# EAGLE design ConfundusV2 (EAGLE 9.6.2)
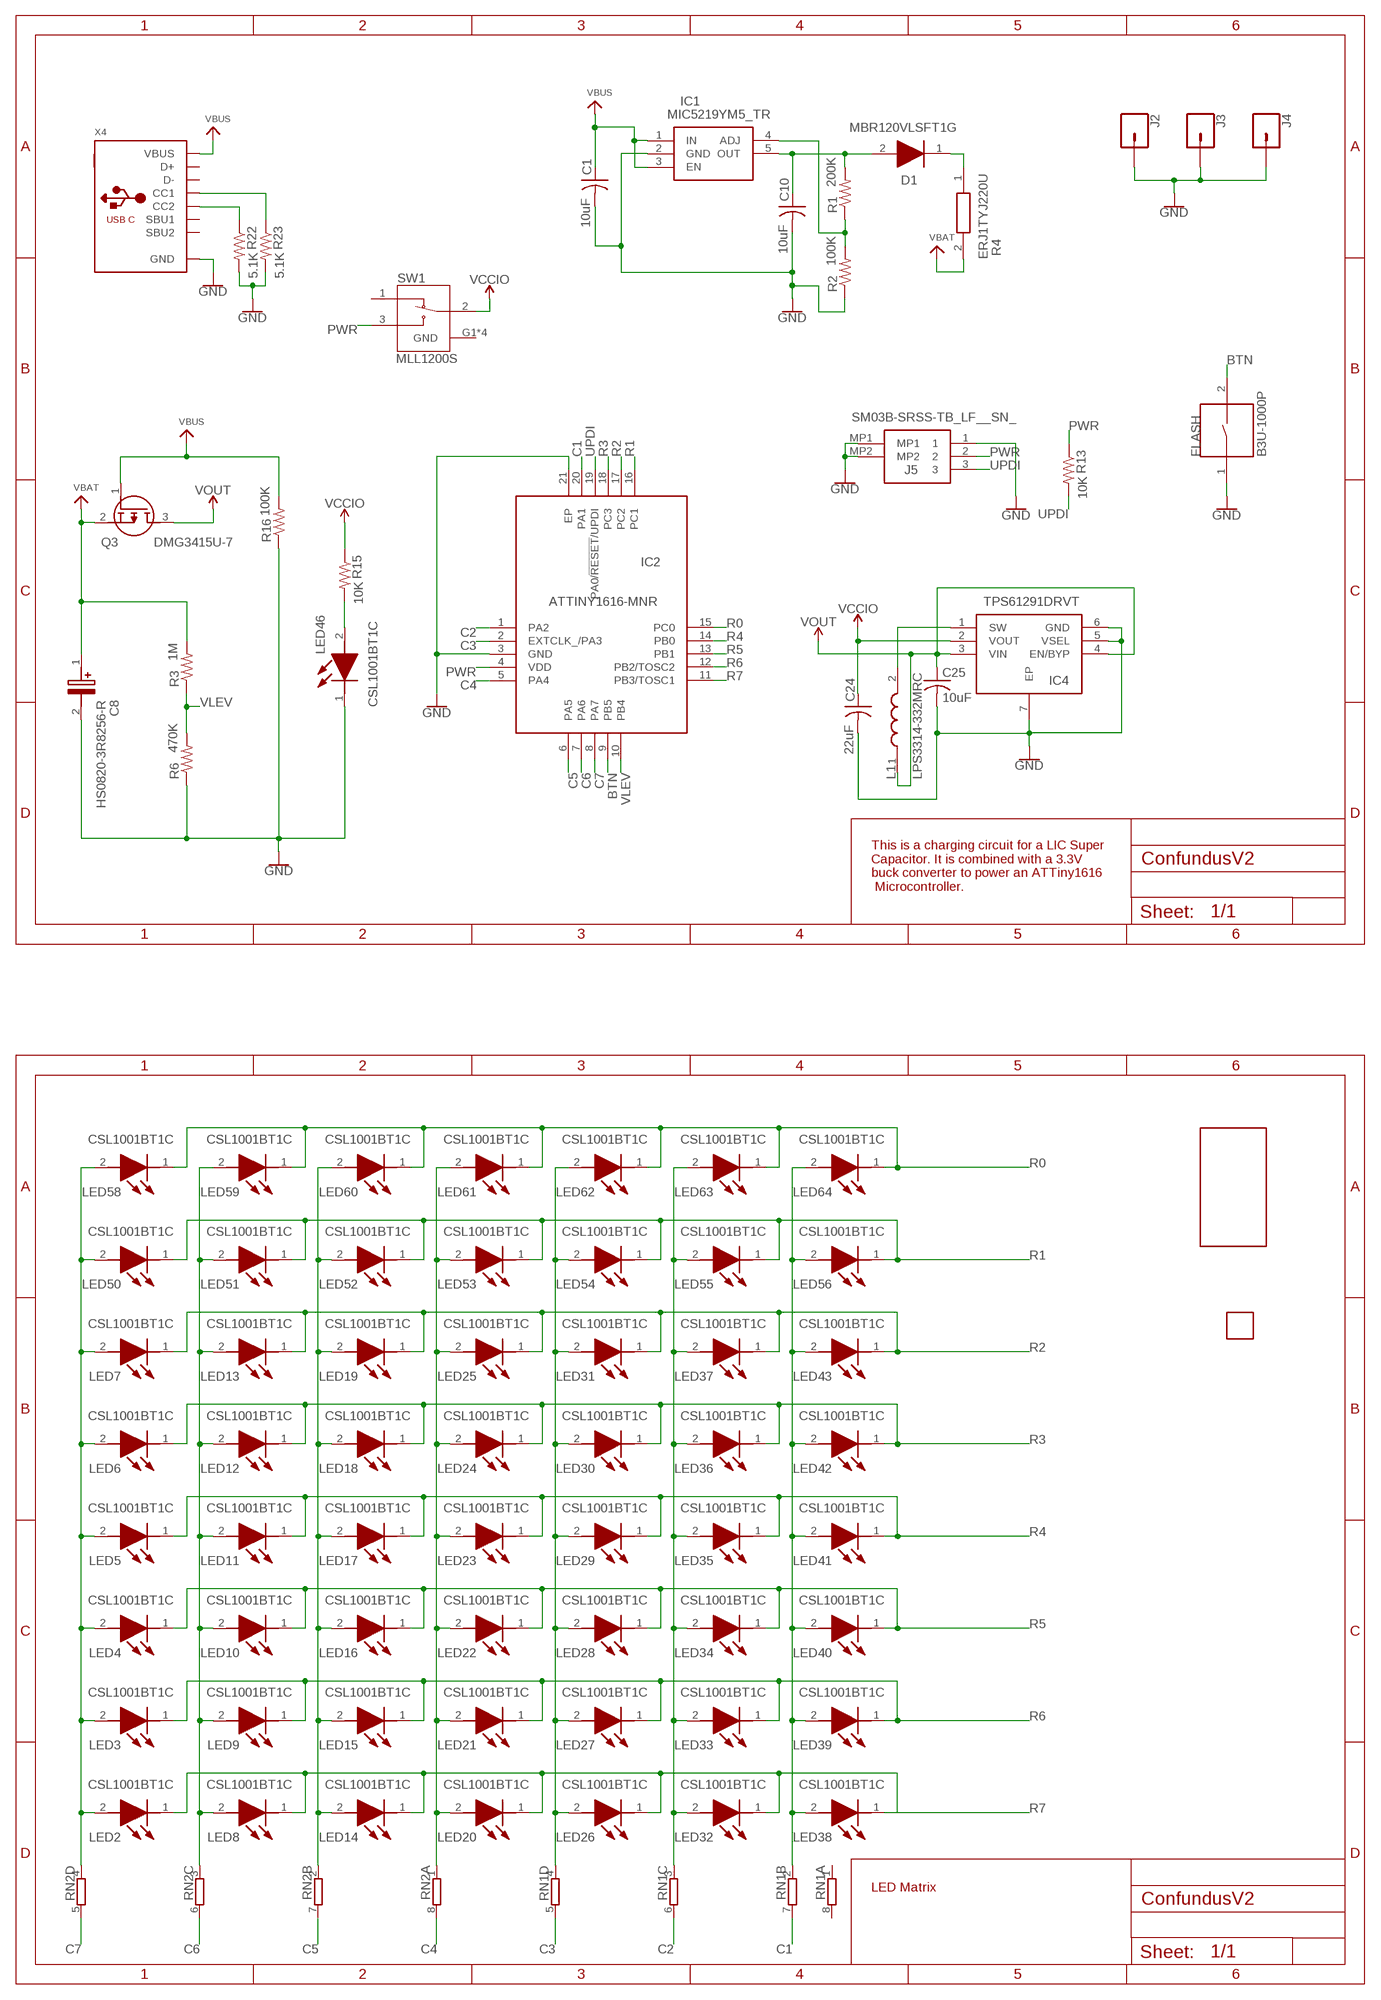
[diagram p0: schematic, sheet 1]

## Parts
C1  10uF  C-USC0402  [C0402]
C8  HS0820-3R8256-R  [CAPPRD350W65D850H2200]
C10  10uF  C-USC0402  [C0402]
C24  22uF  C-USC0402  [C0402]
C25  10uF  C-USC0402  [C0402]
D1  MBR120VLSFT1G  [SODFL3616X98N]
FLASH  B3U-1000P  [SW_B3U-1000P]
IC1  MIC5219YM5_TR  [SOT95P280X145-5N]
IC2  ATTINY1616-MNR  [QFN40P300X300X90-21N]
IC4  TPS61291DRVT  [SON65P200X200X80-7N]
J2  CONN_01PTH_2MM  [1X01_2MM]
J3  CONN_01PTH_2MM  [1X01_2MM]
J4  CONN_01PTH_2MM  [1X01_2MM]
J5  SM03B-SRSS-TB_LF__SN_  [SM03BSRSSTBLFSN]
L1  LPS3314-332MRC  [LPS3314332MRC]
LED2  CSL1001BT1C  [CSL1001BT1C]
LED3  CSL1001BT1C  [CSL1001BT1C]
LED4  CSL1001BT1C  [CSL1001BT1C]
LED5  CSL1001BT1C  [CSL1001BT1C]
LED6  CSL1001BT1C  [CSL1001BT1C]
LED7  CSL1001BT1C  [CSL1001BT1C]
LED8  CSL1001BT1C  [CSL1001BT1C]
LED9  CSL1001BT1C  [CSL1001BT1C]
LED10  CSL1001BT1C  [CSL1001BT1C]
LED11  CSL1001BT1C  [CSL1001BT1C]
LED12  CSL1001BT1C  [CSL1001BT1C]
LED13  CSL1001BT1C  [CSL1001BT1C]
LED14  CSL1001BT1C  [CSL1001BT1C]
LED15  CSL1001BT1C  [CSL1001BT1C]
LED16  CSL1001BT1C  [CSL1001BT1C]
LED17  CSL1001BT1C  [CSL1001BT1C]
LED18  CSL1001BT1C  [CSL1001BT1C]
LED19  CSL1001BT1C  [CSL1001BT1C]
LED20  CSL1001BT1C  [CSL1001BT1C]
LED21  CSL1001BT1C  [CSL1001BT1C]
LED22  CSL1001BT1C  [CSL1001BT1C]
LED23  CSL1001BT1C  [CSL1001BT1C]
LED24  CSL1001BT1C  [CSL1001BT1C]
LED25  CSL1001BT1C  [CSL1001BT1C]
LED26  CSL1001BT1C  [CSL1001BT1C]
LED27  CSL1001BT1C  [CSL1001BT1C]
LED28  CSL1001BT1C  [CSL1001BT1C]
LED29  CSL1001BT1C  [CSL1001BT1C]
LED30  CSL1001BT1C  [CSL1001BT1C]
LED31  CSL1001BT1C  [CSL1001BT1C]
LED32  CSL1001BT1C  [CSL1001BT1C]
LED33  CSL1001BT1C  [CSL1001BT1C]
LED34  CSL1001BT1C  [CSL1001BT1C]
LED35  CSL1001BT1C  [CSL1001BT1C]
LED36  CSL1001BT1C  [CSL1001BT1C]
LED37  CSL1001BT1C  [CSL1001BT1C]
LED38  CSL1001BT1C  [CSL1001BT1C]
LED39  CSL1001BT1C  [CSL1001BT1C]
LED40  CSL1001BT1C  [CSL1001BT1C]
LED41  CSL1001BT1C  [CSL1001BT1C]
LED42  CSL1001BT1C  [CSL1001BT1C]
LED43  CSL1001BT1C  [CSL1001BT1C]
LED46  CSL1001BT1C  [CSL1001BT1C]
LED50  CSL1001BT1C  [CSL1001BT1C]
LED51  CSL1001BT1C  [CSL1001BT1C]
LED52  CSL1001BT1C  [CSL1001BT1C]
LED53  CSL1001BT1C  [CSL1001BT1C]
LED54  CSL1001BT1C  [CSL1001BT1C]
LED55  CSL1001BT1C  [CSL1001BT1C]
LED56  CSL1001BT1C  [CSL1001BT1C]
LED58  CSL1001BT1C  [CSL1001BT1C]
LED59  CSL1001BT1C  [CSL1001BT1C]
LED60  CSL1001BT1C  [CSL1001BT1C]
LED61  CSL1001BT1C  [CSL1001BT1C]
LED62  CSL1001BT1C  [CSL1001BT1C]
LED63  CSL1001BT1C  [CSL1001BT1C]
LED64  CSL1001BT1C  [CSL1001BT1C]
Q3  DMG3415U-7  [SOT96P240X100-3N]
R1  200K  R-US_R0402  [R0402]
R2  100K  R-US_R0402  [R0402]
R3  1M  R-US_R0402  [R0402]
R4  ERJ1TYJ220U  [ERJ1TRQF1R0U]
R6  470K  R-US_R0402  [R0402]
R13  10K  R-US_R0402  [R0402]
R15  10K  R-US_R0402  [R0402]
R16  100K  R-US_R0402  [R0402]
R22  5.1K  R-US_R0402  [R0402]
R23  5.1K  R-US_R0402  [R0402]
RN1  4R-N0402ARV341  [4X0402ARV341]
RN2  4R-N0402ARV341  [4X0402ARV341]
SW1  MLL1200S  [SW_MLL1200S]
U$1  SMARTT  [SMARTT]
U$2  SMARTT_SMALL  [SMARTT_SMALL]
X4  MICROBUILDER_USB_C  [MICROBUILDER_USB_C_CUSB31-CFM2AX-01-X]

## Nets
BTN: FLASH.2 IC2.9(PB5)
C1: IC2.20(PA1) RN1.7
C2: IC2.1(PA2) RN1.6
C3: IC2.2(EXTCLK_/PA3) RN1.5
C4: IC2.5(PA4) RN2.8
C5: IC2.6(PA5) RN2.7
C6: IC2.7(PA6) RN2.6
C7: IC2.8(PA7) RN2.5
GND: C1.2 C8.2(-) C10.2 C24.2 C25.2 FLASH.1 IC1.2(GND) IC2.3(GND) IC2.21(EP) IC4.5(VSEL) IC4.6(GND) IC4.7(EP) J2.1 J3.1 J4.1 J5.1 J5.MP1 J5.MP2 LED46.1(K) R2.1 R6.1 R16.1 R22.2 R23.2 X4.A1B12(GND) X4.B1A12(GND)
N$1: LED38.2(A) LED39.2(A) LED40.2(A) LED41.2(A) LED42.2(A) LED43.2(A) LED56.2(A) LED64.2(A) RN1.2
N$2: LED32.2(A) LED33.2(A) LED34.2(A) LED35.2(A) LED36.2(A) LED37.2(A) LED55.2(A) LED63.2(A) RN1.3
N$3: LED26.2(A) LED27.2(A) LED28.2(A) LED29.2(A) LED30.2(A) LED31.2(A) LED54.2(A) LED62.2(A) RN1.4
N$4: LED20.2(A) LED21.2(A) LED22.2(A) LED23.2(A) LED24.2(A) LED25.2(A) LED53.2(A) LED61.2(A) RN2.1
N$5: LED14.2(A) LED15.2(A) LED16.2(A) LED17.2(A) LED18.2(A) LED19.2(A) LED52.2(A) LED60.2(A) RN2.2
N$6: LED8.2(A) LED9.2(A) LED10.2(A) LED11.2(A) LED12.2(A) LED13.2(A) LED51.2(A) LED59.2(A) RN2.3
N$7: LED2.2(A) LED3.2(A) LED4.2(A) LED5.2(A) LED6.2(A) LED7.2(A) LED50.2(A) LED58.2(A) RN2.4
N$8: R22.1 X4.B5(CC2)
N$9: R23.1 X4.A5(CC1)
N$10: C10.1 D1.2(A) IC1.5(OUT) R1.2
N$11: IC1.4(ADJ) R1.1 R2.2
N$12: D1.1(K) R4.1
N$28: IC4.1(SW) L1.2
N$36: LED46.2(A) R15.2
PWR: IC2.4(VDD) J5.2 R13.1 SW1.3
R0: IC2.15(PC0) LED58.1(K) LED59.1(K) LED60.1(K) LED61.1(K) LED62.1(K) LED63.1(K) LED64.1(K)
R1: IC2.16(PC1) LED50.1(K) LED51.1(K) LED52.1(K) LED53.1(K) LED54.1(K) LED55.1(K) LED56.1(K)
R2: IC2.17(PC2) LED7.1(K) LED13.1(K) LED19.1(K) LED25.1(K) LED31.1(K) LED37.1(K) LED43.1(K)
R3: IC2.18(PC3) LED6.1(K) LED12.1(K) LED18.1(K) LED24.1(K) LED30.1(K) LED36.1(K) LED42.1(K)
R4: IC2.14(PB0) LED5.1(K) LED11.1(K) LED17.1(K) LED23.1(K) LED29.1(K) LED35.1(K) LED41.1(K)
R5: IC2.13(PB1) LED4.1(K) LED10.1(K) LED16.1(K) LED22.1(K) LED28.1(K) LED34.1(K) LED40.1(K)
R6: IC2.12(PB2/TOSC2) LED3.1(K) LED9.1(K) LED15.1(K) LED21.1(K) LED27.1(K) LED33.1(K) LED39.1(K)
R7: IC2.11(PB3/TOSC1) LED2.1(K) LED8.1(K) LED14.1(K) LED20.1(K) LED26.1(K) LED32.1(K) LED38.1(K)
UPDI: IC2.19(PA0/!RESET!/UPDI) J5.3 R13.2
VBAT: C8.1(+) Q3.2(S) R3.2 R4.2
VBUS: C1.1 IC1.1(IN) IC1.3(EN) Q3.1(G) R16.2 X4.A4B9(VBUS) X4.B4A9(VBUS)
VCCIO: C24.1 IC4.2(VOUT) R15.1 SW1.2
VLEV: IC2.10(PB4) R3.1 R6.2
VOUT: C25.1 IC4.3(VIN) IC4.4(EN/BYP) L1.1 Q3.3(D)
Unconnected: RN1.1 RN1.8 SW1.1 X4.A6(D+) X4.A7(D-) X4.A8(SBU1) X4.B6(D+) X4.B7(D-) X4.B8(SBU2)

## Notes on the sheet
- This is a charging circuit for a LIC Super  
  Capacitor. It is combined with a 3.3V 
  buck converter to power an ATTiny1616
   Microcontroller.
- LED Matrix

## Power pins joined to a net without a drawn wire
GND: SW1.G1(GND) SW1.G2(GND) SW1.G3(GND) SW1.G4(GND)

## Library data of the parts
C1 C10 C24 C25 = adafruit:C-US: CAPACITOR, American symbol
C8 = HS0820-3R8256-R:HS0820-3R8256-R: Supercapacitors / Ultracapacitors Eaton HS Hybrid Supercapacitor, 3.8V, 25F, 0.65 ohm Source: Datasheet <https://www.eaton.com/content/dam/eaton/products/electronic-components/resources/data-sheet/eaton-supercapacitor-hybrid-cylindrical-cells-data-sheet.pdf>; DESCRIPTION: Supercapacitors / Ultracapacitors Eaton HS Hybrid Supercapacitor, 3.8V, 25F, 0.65 ohm; HEIGHT: 22mm; MANUFACTURER_NAME: Eaton; MANUFACTURER_PART_NUMBER: HS0820-3R8256-R; MOUSER_PART_NUMBER: 504-HS0820-3R8256-R; MOUSER_PRICE-STOCK: https://www.mouser.co.uk/ProductDetail/Eaton-Electronics/HS0820-3R8256-R?qs=MyNHzdoqoQLzawSJmBp97w%3D%3D
D1 = MBR120VLSFT1G:MBR120VLSFT1G: Diode Schottky 20V 1A SOD123FL ON Semi MBR120VLSFT1G, SMT Schottky Diode, 20V 1A, 2-Pin SOD-123FL Source: Datasheet <http://www.onsemi.com/pub/Collateral/MBR120VLSFT1-D.PDF>; DESCRIPTION: Diode Schottky 20V 1A SOD123FL ON Semi MBR120VLSFT1G, SMT Schottky Diode, 20V 1A, 2-Pin SOD-123FL; HEIGHT: 0.98mm; MANUFACTURER_NAME: ON Semiconductor; MANUFACTURER_PART_NUMBER: MBR120VLSFT1G; MOUSER_PART_NUMBER: 863-MBR120VLSFT1G; MOUSER_PRICE-STOCK: https://www.mouser.co.uk/ProductDetail/ON-Semiconductor/MBR120VLSFT1G?qs=3JMERSakebpX%252BkItPpFCkg%3D%3D
FLASH = B3U-1000P:B3U-1000P: Switch Tactile N.O. SPST Round Button Gull Wing 0.05A 12VDC 1.5N SMD Embossed T/R; AVAILABILITY: Unavailable; DESCRIPTION: Switch Tactile N.O. SPST Round Button Gull Wing 0.05A 12VDC 1.5N SMD Embossed T/R; MF: Omron; MP: B3U-1000P; PACKAGE: None; PRICE: None
IC1 = MIC5219YM5_TR:MIC5219YM5_TR: Micrel MIC5219YM5 TR, Low Noise LDO Voltage Regulator, 500mA Adjustable, +/-1% 5-Pin, SOT-23 Source: Datasheet <https://www.mouser.co.uk/datasheet/2/268/mic5219-1082354.pdf>; ARROW_PART_NUMBER: MIC5219YM5 TR; ARROW_PRICE-STOCK: https://www.arrow.com/en/products/mic5219ym5-tr/microchip-technology.html?utm_currency=USD&region=nac; DESCRIPTION: Micrel MIC5219YM5 TR, Low Noise LDO Voltage Regulator, 500mA Adjustable, +/-1% 5-Pin, SOT-23; HEIGHT: 1.45mm; MANUFACTURER_NAME: Microchip; MANUFACTURER_PART_NUMBER: MIC5219YM5 TR
IC2 = ATTINY1616-MNR:ATTINY1616-MNR: Microchip ATTINY1616-MNR, 8bit AVR Microcontroller, 20MHz, 16 kB Flash, 20-Pin VQFN Source: Datasheet <https://datasheet.datasheetarchive.com/originals/distributors/DKDS41/DSANUWW0026757.pdf>; DESCRIPTION: Microchip ATTINY1616-MNR, 8bit AVR Microcontroller, 20MHz, 16 kB Flash, 20-Pin VQFN; HEIGHT: 0.9mm; MANUFACTURER_NAME: Microchip; MANUFACTURER_PART_NUMBER: ATTINY1616-MNR; MOUSER_PART_NUMBER: 556-ATTINY1616MNR; MOUSER_PRICE-STOCK: https://www.mouser.co.uk/ProductDetail/Microchip-Technology/ATTINY1616-MNR?qs=HXFqYaX1Q2yKNpuKQU9qww%3D%3D
IC4 = TPS61291DRVT:TPS61291DRVT: Texas Instruments TPS61291DRVT, Boost Converter, Boost 250mA Selectable, 2.5 V, 3 V, 3.3 V, 6-Pin SON Source: Datasheet <http://uk.rs-online.com/web/p/products/9143112P>; ARROW_PART_NUMBER: TPS61291DRVT; ARROW_PRICE-STOCK: https://www.arrow.com/en/products/tps61291drvt/texas-instruments?utm_currency=USD&region=nac; DESCRIPTION: Texas Instruments TPS61291DRVT, Boost Converter, Boost 250mA Selectable, 2.5 V, 3 V, 3.3 V, 6-Pin SON; HEIGHT: 0.8mm; MANUFACTURER_NAME: Texas Instruments; MANUFACTURER_PART_NUMBER: TPS61291DRVT; MOUSER_PART_NUMBER: 595-TPS61291DRVT; MOUSER_PRICE-STOCK: https://www.mouser.co.uk/ProductDetail/Texas-Instruments/TPS61291DRVT?qs=6E8igxPflKclok%252BjdNvlFw%3D%3D
J2-J4 = SparkFun-Connectors:CONN_01: Single connection point. Often used as Generic Header-pin footprint for 0.1 inch spaced/style header connections On any of the 0.1 inch spaced packages, you can populate with these: Break Away Headers - Straight <https://www.sparkfun.com/products/116> (PRT-00116) Break Away Male Headers - Right Angle <https://www.sparkfun.com/products/553> (PRT-00553) Female Headers <https://www.sparkfun.com/products/115> (PRT-00115) Break Away Headers - Machine Pin <https://www.sparkfun.com/products/117> (PRT-00117) Break Away Female Headers - Swiss Machine Pin <https://www.sparkfun.com/products/743> (PRT-00743) This device is also useful as a general connection point to wire up your design to another part of your project. Our various solder wires solder well into these plated through hole pads. Hook-Up Wire - Assortment (Stranded, 22 AWG) <https://www.sparkfun.com/products/11375> (PRT-11375) Hook-Up Wire - Assortment (Solid Core, 22 AWG) <https://www.sparkfun.com/products/11367> (PRT-11367) View the entire wire category on our website here <https://www.sparkfun.com/categories/141> Special notes: SMTSO-256-ET is a "flush mount" nut for a 4-40 screw. We mostly use this on specialty testbeds; it is a nice way to connect hardware to your PCB at an adjustable hieght. Also note, the SNAP packages are for using a snappable style connector. We sell a baggie of snaps and they are also used on two LilyPad designs: Snap Assortment - 30 pack (male and female) <https://www.sparkfun.com/products/11347> (DEV-11347) LilyPad Arduino SimpleSnap <https://www.sparkfun.com/products/10941> (DEV-10941) LilyPad SimpleSnap Protoboard <https://www.sparkfun.com/products/10940> (DEV-10940)
J5 = SM03B-SRSS-TB_LF__SN_:SM03B-SRSS-TB_LF__SN_: Wire To Board / Wire To Wire Connector RoHS Source: Datasheet <http://www.jst-mfg.com/product/pdf/eng/eSR.pdf>; DESCRIPTION: Wire To Board / Wire To Wire Connector RoHS; HEIGHT: 2.9mm; MANUFACTURER_NAME: JST (JAPAN SOLDERLESS TERMINALS); MANUFACTURER_PART_NUMBER: SM03B-SRSS-TB(LF)(SN)
L1 = LPS3314-332MRC:LPS3314-332MRC: Fixed Inductors 3.3uH Shld 20% 1.3A 145 mOhms Source: Datasheet <https://www.coilcraft.com/en-us/products/power/shielded-inductors/ferrite-drum/lps/lps3314/lps3314-332/?srsltid=AfmBOooJ-03Gs0rNWcGqeoTuLqck1D2mawZBm0JVt5l_5EiqNMYhV9jP>; DESCRIPTION: Fixed Inductors 3.3uH Shld 20% 1.3A 145 mOhms; HEIGHT: 1.4mm; MANUFACTURER_NAME: COILCRAFT; MANUFACTURER_PART_NUMBER: LPS3314-332MRC; MOUSER_PART_NUMBER: 994-LPS3314-332MRC; MOUSER_PRICE-STOCK: https://www.mouser.co.uk/ProductDetail/Coilcraft/LPS3314-332MRC?qs=QQJxVsr8EGYvjTTKn6zmJw%3D%3D
LED2-LED43 LED46 LED50-LED56 LED58-LED64 = CSL1001BT1C:CSL1001BT1C: Blue 468nm LED Indication - Discrete 2.8V 0603 (1608 Metric) Source: Datasheet <https://fscdn.rohm.com/en/products/databook/datasheet/opto/led/chip_mono/csl1001bt1(c)-e.pdf>; DESCRIPTION: Blue 468nm LED Indication - Discrete 2.8V 0603 (1608 Metric); HEIGHT: 1.16mm; MANUFACTURER_NAME: ROHM Semiconductor; MANUFACTURER_PART_NUMBER: CSL1001BT1C; MOUSER_PART_NUMBER: 755-CSL1001BT1C; MOUSER_PRICE-STOCK: https://www.mouser.co.uk/ProductDetail/ROHM-Semiconductor/CSL1001BT1C?qs=HoCaDK9Nz5fqNTX3Pg0ReA%3D%3D
Q3 = DMG3415U-7:DMG3415U-7: P-CHANNEL ENHANCEMENT MODE MOSFET Source: Datasheet <https://datasheet.lcsc.com/szlcsc/Diodes-Incorporated-DMG3415U-7_C96616.pdf>; DESCRIPTION: P-CHANNEL ENHANCEMENT MODE MOSFET; HEIGHT: 1mm; LCSC_PART_NUMBER: C96616; LCSC_PRICE-STOCK: https://lcsc.com/product-detail/MOSFET_Diodes-Incorporated_DMG3415U-7_Diodes-Incorporated-DMG3415U-7_C96616.html; MANUFACTURER_NAME: Diodes Inc.; MANUFACTURER_PART_NUMBER: DMG3415U-7
R1-R3 R6 R13 R15 R16 R22 R23 = adafruit:R-US_: RESISTOR, American symbol
R4 = ERJ1TYJ220U:ERJ1TYJ220U: PANASONIC - ERJ1TYJ220U - RES, 22R, 5%, 1W, 2512, THICK FILM Source: Datasheet <https://industrial.panasonic.com/cdbs/www-data/pdf/RDA0000/AOA0000C84.pdf>; DESCRIPTION: PANASONIC - ERJ1TYJ220U - RES, 22R, 5%, 1W, 2512, THICK FILM; HEIGHT: 0.7mm; MANUFACTURER_NAME: Panasonic; MANUFACTURER_PART_NUMBER: ERJ1TYJ220U
RN1 RN2 = resistor-dil:4R-N: Array Chip Resistor Source: RS Component / Phycomp; OC_FARNELL: unknown; OC_NEWARK: unknown
SW1 = MLL1200S:MLL1200S: Switch Slide SPDT Side Slide 0.3A 4VDC Gull Wing SMD Box Check prices <https://pricing.snapeda.com/parts/MLL1200S/TE%20Connectivity/view-part?ref=eda>; AVAILABILITY: In Stock; COMMENT: 1437575-1; DESCRIPTION: Slide Switch SPDT Surface Mount, Right Angle; MF: TE Connectivity; MP: MLL1200S; PACKAGE: None; PRICE: None; PURCHASE-URL: https://pricing.snapeda.com/search/part/MLL1200S/?ref=eda
U$1 = Bitmaps:SMARTT
U$2 = Bitmaps:SMARTT_SMALL
X4 = Adafruit Feather STM32F405 Express:MICROBUILDER_USB_C: USB Type-C USB 2.0 Connector

## Board
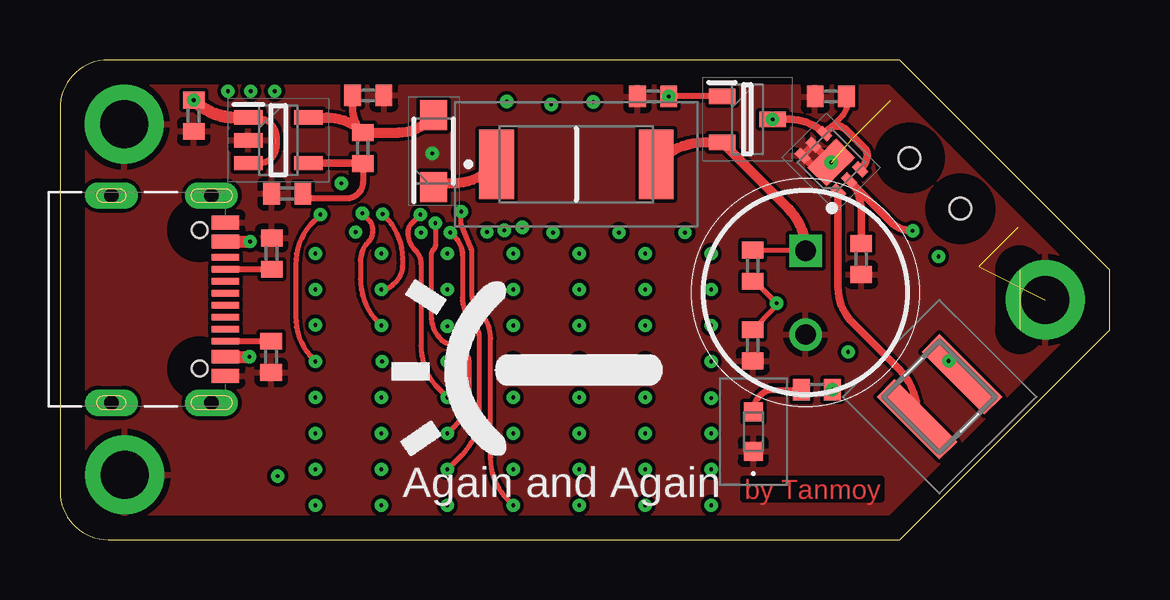
[diagram p1: board, top side]
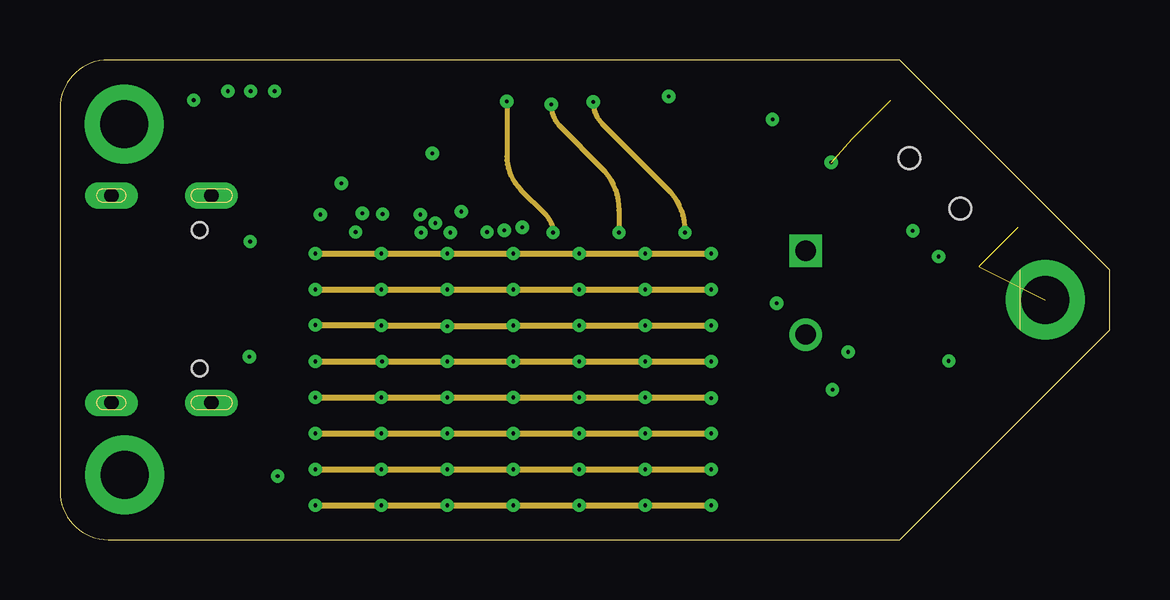
[diagram p2: board, inner layer Route2]
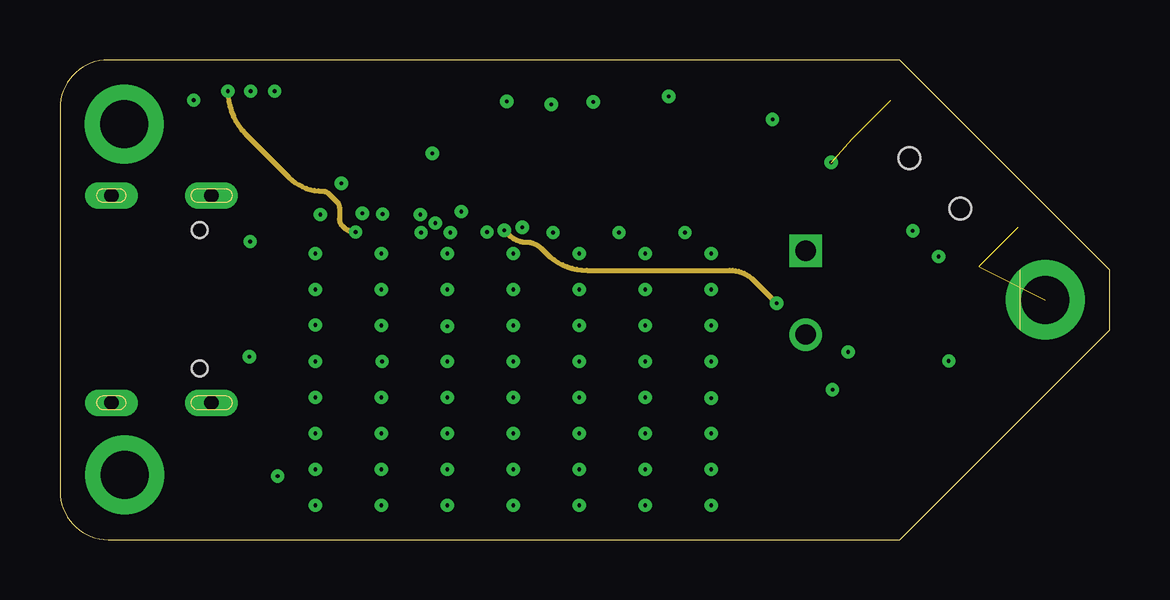
[diagram p3: board, inner layer Route3]
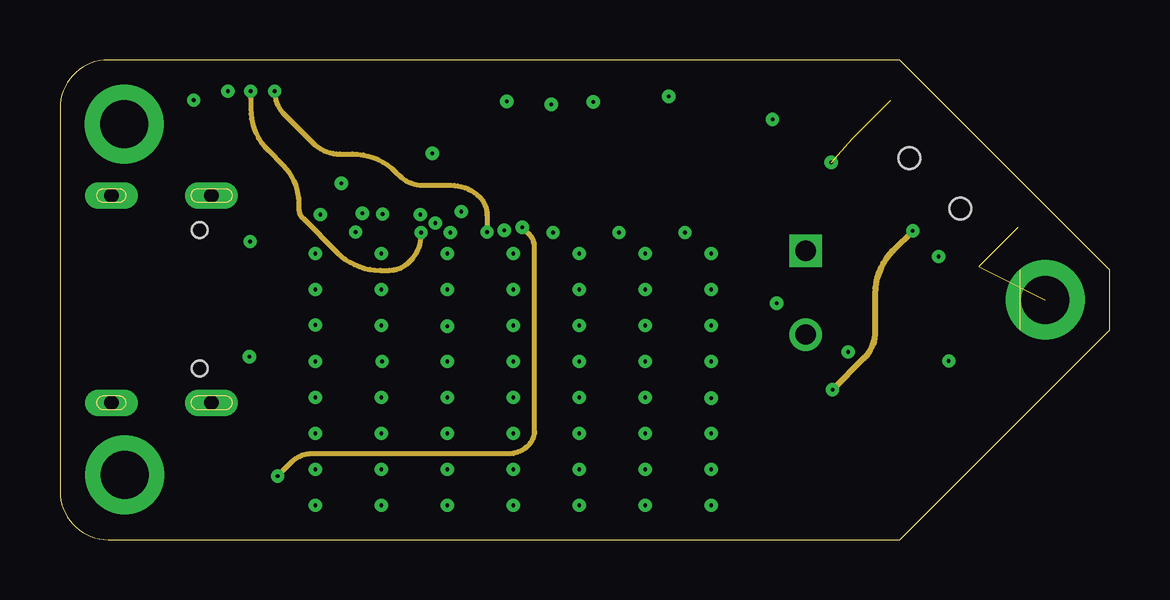
[diagram p4: board, inner layer Route14]
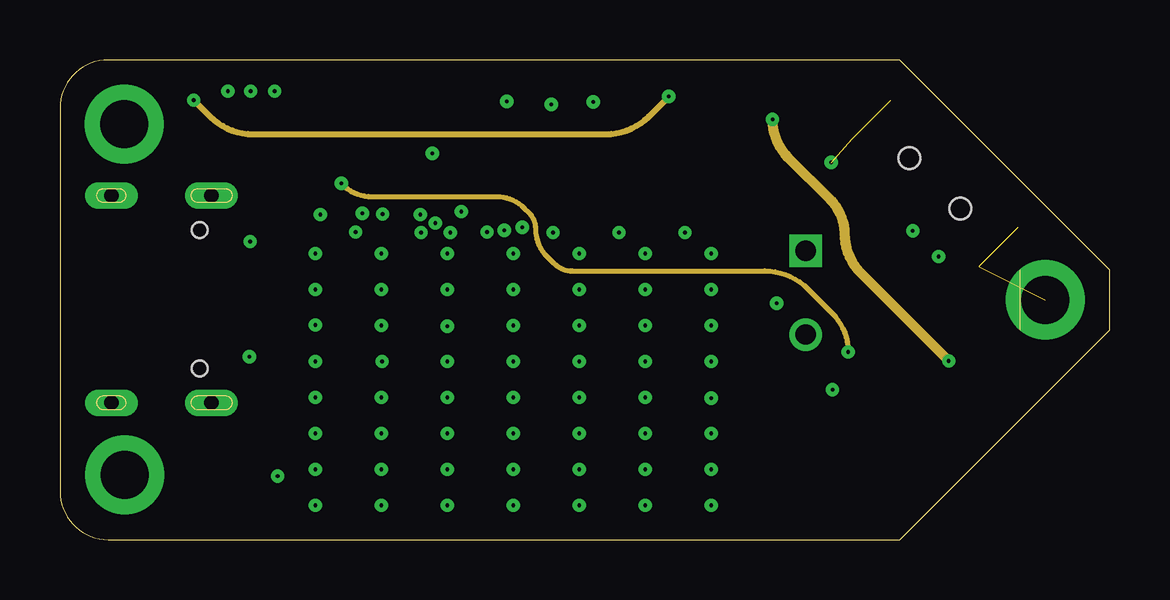
[diagram p5: board, inner layer Route15]
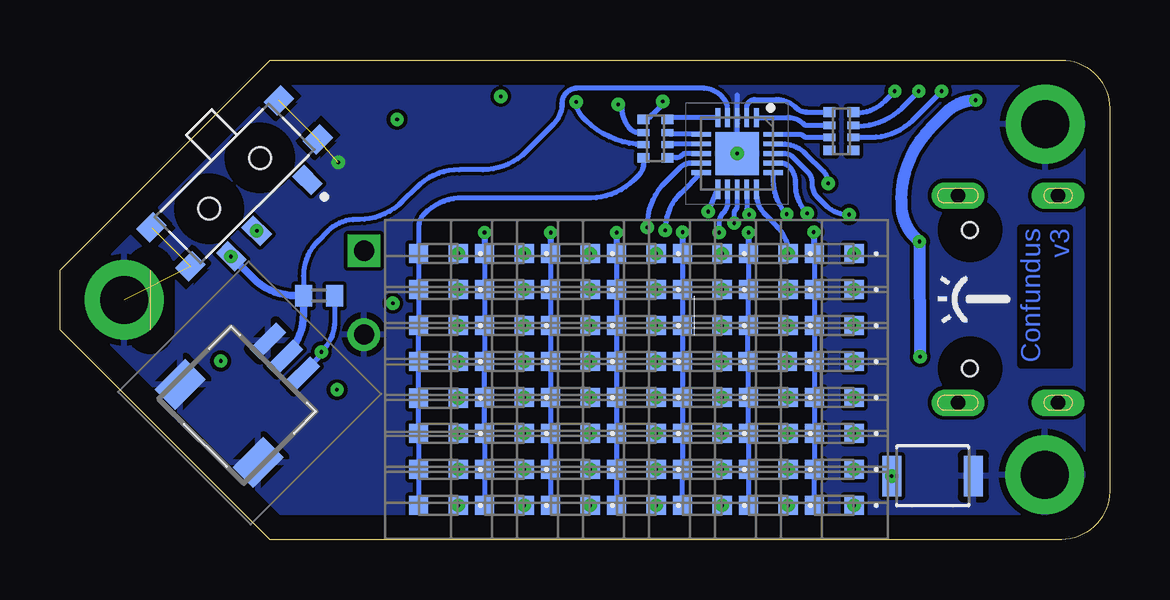
[diagram p6: board, bottom side, seen from below]

Size 43.75 x 20 mm. Coordinates in mm from the lower left corner, seen from the top.
Outline: 40,11.25 40,8.75
Outline: 35,20 2,20 arc90 0,18 0,2 arc90 2,0 35,0 43.75,8.75 43.75,11.25 35,20
Copper layers (1+2*3+14*15+16): Top 0.035mm / dielectric 0.1mm / Route2 0.035mm / dielectric 0.1mm / Route3 0.035mm / dielectric 0.19mm / Route14 0.035mm / dielectric 0.1mm / Route15 0.035mm / dielectric 0.1mm / Bottom 0.035mm
Design rules "default *": minimum track width 6mil, minimum drill 0.35mm, track to track 6mil, track to pad 6mil, pad to pad 6mil, via to via 6mil, smd to smd 6mil, copper to edge 40mil, drill to drill 6mil, minimum pad ring 10mil, minimum via ring 8mil, stop-mask expansion 4mil, vias tented up to drill 0mil, thermal gap 10mil
bRestrict: area 33.8,17.5 to 35.5,19.2; area 32.1,15.9 to 33.9,17.6; area 37.5,10.5 to 39.2,12.2; area 39,12 to 40.9,13.9

### Footprints (pad centres in the part's own frame; a part is rotated, then mirrored left to right if it is on the bottom)
C0402 = smd 0.7 x 0.9: 1 -0.65,0; 2 0.65,0
CAPPRD350W65D850H2200 = drill 0.85 pad 1.275 square: 1 0,0 | drill 0.85 pad 1.275: 2 3.5,0
SODFL3616X98N = smd 1.24 x 1.12: 1 -1.5,0; 2 1.5,0
SW_B3U-1000P = smd 0.8 x 1.7: 1 -1.7,0; 2 1.7,0
SOT95P280X145-5N = smd 1.2 x 0.6: 1 -1.25,0.95; 2 -1.25,0; 3 -1.25,-0.95; 4 1.25,-0.95; 5 1.25,0.95
QFN40P300X300X90-21N = smd 0.8 x 0.2: 1 -1.5,0.8; 2 -1.5,0.4; 3 -1.5,0; 4 -1.5,-0.4; 5 -1.5,-0.8; 11 1.5,-0.8; 12 1.5,-0.4; 13 1.5,0; 14 1.5,0.4; 15 1.5,0.8 | smd 0.2 x 0.8: 6 -0.8,-1.5; 7 -0.4,-1.5; 8 0,-1.5; 9 0.4,-1.5; 10 0.8,-1.5; 16 0.8,1.5; 17 0.4,1.5; 18 0,1.5; 19 -0.4,1.5; 20 -0.8,1.5 | smd 1.8 x 1.8: 21 0,0
SON65P200X200X80-7N = smd 0.6 x 0.35: 1 -1.05,0.65; 2 -1.05,0; 3 -1.05,-0.65; 4 1.05,-0.65; 5 1.05,0; 6 1.05,0.65 | smd 1.1 x 1.7: 7 0,0
1X01_2MM = drill 2 pad 3.302: 1 0,0
SM03BSRSSTBLFSN = smd 0.6 x 1.55: 1 -1,2.463; 2 0,2.463; 3 1,2.463 | smd 1.2 x 1.8: MP1 -2.3,-1.413; MP2 2.3,-1.413
LPS3314332MRC = smd 1.05 x 3.7: 1 -1.325,0; 2 1.325,0
CSL1001BT1C = smd 0.8 x 0.8: 1 0,-0.825; 2 0,0.825
SOT96P240X100-3N = smd 1.1 x 0.65: 1 -1.05,0.96; 2 -1.05,-0.96; 3 1.05,0
R0402 = smd 0.7 x 0.9: 1 -0.65,0; 2 0.65,0
ERJ1TRQF1R0U = smd 1.45 x 2.9: 1 -3.325,0; 2 3.325,0
4X0402ARV341 = smd 0.4 x 0.5: 1 -0.8,-0.5; 4 0.8,-0.5; 5 0.8,0.5; 8 -0.8,0.5 | smd 0.3 x 0.5: 2 -0.25,-0.5; 3 0.25,-0.5; 6 0.25,0.5; 7 -0.25,0.5
SW_MLL1200S = smd 0.7 x 1.1: 1 -2.25,2.05; 2 0.75,2.05; 3 2.25,2.05 | smd 1 x 0.8: G1 -3.75,1.15; G2 3.75,1.15; G3 -3.75,-1.15; G4 3.75,-1.15 | hole 0.9: -1.5,0; 1.5,0
MICROBUILDER_USB_C_CUSB31-CFM2AX-01-X = smd 0.575 x 1.15: A1B12 -3.2,3.545; A4B9 -2.4,3.545; B1A12 3.2,3.545; B4A9 2.4,3.545 | smd 0.275 x 1.15: A5 -1.25,3.545; A6 -0.25,3.545; A7 0.25,3.545; A8 1.25,3.545; B5 1.75,3.545; B6 0.75,3.545; B7 -0.75,3.545; B8 -1.75,3.545 | drill 0.6 pad 1 long: M1 -4.32,2.97; M2 4.32,2.97; M3 -4.32,-1.21; M4 4.32,-1.21 | hole 0.65: 2.89,2.47; -2.89,2.47

### Placement (x,y rotation side)
C1  5.58,17.68 270 top
C8  31.07,12.05 270 top
C10  12.85,18.52 0 top
C24  33.4,11.7 270 top
C25  32.12,18.48 180 top
D1  15.57,16.2 90 top
FLASH  7.38,2.65 180 bottom
IC1  9.1,16.65 0 top
IC2  15.53,16.1 270 bottom
IC4  32.15,15.72 135 top
J2  2.7,2.7 0 top
J3  41.08,10 0 top
J4  2.67,17.32 0 top
J5  36.12,5.84 315 bottom
L1  36.66,5.96 225 top
LED2  27.98,1.43 90 bottom
LED3  27.98,2.92 90 bottom
LED4  27.98,4.42 90 bottom
LED5  27.98,5.9 90 bottom
LED6  27.98,7.42 90 bottom
LED7  27.98,8.93 90 bottom
LED8  25.23,1.43 90 bottom
LED9  25.23,2.92 90 bottom
LED10  25.23,4.42 90 bottom
LED11  25.23,5.92 90 bottom
LED12  25.23,7.42 90 bottom
LED13  25.23,8.93 90 bottom
LED14  22.48,1.43 90 bottom
LED15  22.48,2.92 90 bottom
LED16  22.48,4.42 90 bottom
LED17  22.48,5.92 90 bottom
LED18  22.48,7.42 90 bottom
LED19  22.48,8.93 90 bottom
LED20  19.73,1.43 90 bottom
LED21  19.73,2.92 90 bottom
LED22  19.73,4.42 90 bottom
LED23  19.73,5.92 90 bottom
LED24  19.73,7.42 90 bottom
LED25  19.73,8.93 90 bottom
LED26  16.98,1.43 90 bottom
LED27  16.98,2.92 90 bottom
LED28  16.98,4.42 90 bottom
LED29  16.98,5.92 90 bottom
LED30  16.98,7.42 90 bottom
LED31  16.98,8.93 90 bottom
LED32  14.22,1.43 90 bottom
LED33  14.22,2.92 90 bottom
LED34  14.22,4.42 90 bottom
LED35  14.22,5.92 90 bottom
LED36  14.25,7.42 90 bottom
LED37  14.22,8.93 90 bottom
LED38  11.47,1.43 90 bottom
LED39  11.47,2.92 90 bottom
LED40  11.47,4.42 90 bottom
LED41  11.47,5.92 90 bottom
LED42  11.47,7.42 90 bottom
LED43  11.47,8.93 90 bottom
LED46  28.9,4.5 0 top
LED50  27.98,10.43 90 bottom
LED51  25.23,10.43 90 bottom
LED52  22.48,10.43 90 bottom
LED53  19.73,10.43 90 bottom
LED54  16.98,10.43 90 bottom
LED55  14.22,10.43 90 bottom
LED56  11.47,10.43 90 bottom
LED58  27.98,11.93 90 bottom
LED59  25.23,11.93 90 bottom
LED60  22.48,11.93 90 bottom
LED61  19.73,11.93 90 bottom
LED62  16.98,11.93 90 bottom
LED63  14.22,11.93 90 bottom
LED64  11.47,11.93 90 bottom
Q3  28.65,17.52 0 top
R1  12.62,16.32 90 top
R2  9.47,14.43 0 top
R3  28.88,11.43 90 top
R4  21.52,15.65 0 top
R6  28.88,8.1 90 top
R13  32.95,10.18 0 bottom
R15  31.55,6.25 180 top
R16  24.73,18.48 0 top
R22  8.8,7.62 270 top
R23  8.82,11.93 90 top
RN1  11.18,17.02 90 bottom
RN2  18.93,16.73 270 bottom
SW1  36.47,14.85 225 bottom
U$1  25.55,2.33 90 top
U$2  4.03,11.3 270 top
X4  3.35,10.03 270 top

### Tracks (layer width: path | path; a pad name or v marks a point on that pad's centre or on a via)
BTN  (via drill 0.15)
  Route14 0.2: FLASH.2 9.66,3.24 arc-45 10.47,3.58 18.68,3.58 arc45 19.52,3.92 arc45 19.77,4.53 19.77,12.22 arc45 19.56,12.74 v19.27,13.03
  Bottom 0.2: IC2.9 17.41,15.7 arc-45 17.95,15.47 18.53,14.89 arc-45 19.27,13.1 v19.27,13.03
  other vias: 9.07,2.65
C1
  Bottom 0.2: IC2.20 12.93,16.9 arc45 12.75,16.82 arc-45 12.63,16.77 RN1.7
C2
  Bottom 0.2: IC2.1 13.41,17.6 arc45 12.75,17.32 arc-45 12.63,17.27 RN1.6
C3
  Bottom 0.2: IC2.2 15.12,18.01 arc45 15.03,18.25 arc45 14.78,18.35 13.89,18.35 arc45 13.05,18 arc-45 12.63,17.82 RN1.5
C4
  Bottom 0.203: IC2.5 18.24,17.6 arc-45 RN2.8
C5
  Bottom 0.203: IC2.6 18.24,16.9 arc45 RN2.7
C6
  Bottom 0.203: IC2.7 18.36,16.5 arc-45 RN2.6
C7
  Bottom 0.203: IC2.8 17.64,16.1 arc-45 17.82,16.02 arc45 18.07,15.93 RN2.5
GND  (via drill 0.15)  (4 unrouted)
  Top 0.254: IC4.7
  Top 0.305: IC4.5 arc-45 IC4.5 | IC4.5 IC4.7 arc-45 31.62,15.5 31.5,15.5 arc-45 31.42,15.53 IC4.6 | IC4.5 IC4.6 | IC4.6 arc-45 IC4.6
  Bottom 0.2: IC2.21 IC2.3 15.53,18.55
  other vias: 15.53,16.1 32.15,15.72
  pour Top: 35,0.25 2.25,0.25 arc-90 0.25,2.25 0.25,17.75 arc-90 2.25,19.75 35,19.75 43.5,11.25 43.5,8.75
  pour Bottom: 35,0.25 2.25,0.25 arc-90 0.25,2.25 0.25,17.75 arc-90 2.25,19.75 35,19.75 43.5,11.25 43.5,8.75
N$1  (via drill 0.15)
  Route3 0.2: v7,18.7 arc45 7.74,16.91 9.54,15.11 arc45 10.95,14.53 arc-45 11.21,14.42 11.55,14.07 arc-45 11.65,13.83 11.65,13.38 arc45 11.78,13.07 11.81,13.04 arc45 v12.32,12.82
  Bottom 0.2: LED64.2 LED56.2 LED43.2 LED42.2 LED41.2 LED40.2 LED39.2 LED38.2 | RN1.2 9.94,16.77 arc-45 8.21,17.49 v7,18.7
  Bottom 0.254: v12.32,12.82 12.32,11.98 arc-45 LED64.2
N$2  (via drill 0.15)
  Route14 0.2: v7.95,18.7 7.95,17.97 arc45 8.67,16.23 9.3,15.6 arc-45 9.95,14.03 9.95,13.82 arc45 10.13,13.4 11.56,11.97 arc45 13.35,11.22 13.72,11.22 arc45 14.54,11.56 14.62,11.65 arc45 15.05,12.68 v15.05,12.8
  Bottom 0.2: LED63.2 LED55.2 LED37.2 arc-45 15.07,8.87 LED36.2 arc45 15.05,7.37 LED35.2 LED34.2 LED33.2 LED32.2 arc-45 15.07,1.36 | RN1.3 10.65,17.25 10.45,17.25 arc-45 8.66,17.99 v7.95,18.7
  Bottom 0.254: v15.05,12.8 LED63.2
N$3  (via drill 0.15)
  Route14 0.2: v8.95,18.7 arc45 9.36,17.72 10.53,16.55 arc45 11.67,16.07 12.2,16.07 arc-45 13.99,15.33 14.15,15.18 arc45 15.12,14.78 16.29,14.78 arc-45 17.5,14.28 arc-45 17.8,13.55 v17.8,12.82
  Bottom 0.2: LED62.2 LED54.2 LED31.2 LED30.2 LED29.2 LED28.2 LED27.2 LED26.2 arc-45 17.82,1.36 | RN1.4 10.59,17.82 10.56,17.79 arc-45 9.36,18.29 v8.95,18.7
  Bottom 0.254: v17.8,12.82 LED62.2
N$4  (via drill 0.15)
  Route2 0.2: v18.62,18.27 18.62,15.99 arc45 19.2,14.6 20.23,13.57 arc-45 v20.55,12.8
  Bottom 0.2: LED61.2 LED53.2 LED25.2 LED24.2 LED23.2 LED22.2 LED21.2 LED20.2 | v18.62,18.27 18.62,18.15 18.98,17.8 | 18.98,17.8 arc45 18.98,17.8 | 18.98,17.8 19.13,17.65 arc45 RN2.1
  Bottom 0.254: v20.55,12.8 LED61.2
N$5  (via drill 0.15)
  Route2 0.2: v20.48,18.15 arc45 20.86,17.21 22.56,15.52 arc-45 23.3,13.72 v23.3,12.8
  Bottom 0.2: LED60.2 LED52.2 LED19.2 LED18.2 LED17.2 LED16.2 LED15.2 LED14.2
  Bottom 0.203: RN2.2 19.65,16.98 arc45 19.95,17.1 arc45 20.32,18 v20.48,18.15
  Bottom 0.254: v23.3,12.8 LED60.2
N$6  (via drill 0.15)
  Route2 0.2: v22.23,18.25 arc45 22.6,17.35 25.31,14.64 arc-45 26.05,12.85 v26.05,12.8
  Bottom 0.2: LED59.2 LED51.2 LED13.2 LED12.2 LED11.2 LED10.2 LED9.2 LED8.2
  Bottom 0.203: RN2.3 arc45 21.82,17.46 21.96,17.61 arc45 v22.23,18.25
  Bottom 0.254: v26.05,12.8 LED59.2
N$7
  Bottom 0.2: LED2.2 LED3.2 LED4.2 LED5.2 LED6.2 LED7.2 LED50.2 LED58.2 28.8,13.03 arc45 28.57,13.57 arc45 26.95,14.25 21.63,14.25 arc-45 19.83,14.99 19.62,15.2
  Bottom 0.203: RN2.4 19.43,15.68 arc45 19.62,15.2
N$8
  Top 0.254: X4.B5 R22.1
N$9
  Top 0.254: X4.A5 R23.1
N$10
  Top 0.305: C10.1 12.2,18 arc45 R1.2
  Top 0.406: IC1.5 11.12,17.6 arc-45 R1.2 14.13,16.98 arc45 15.36,17.48 D1.2
N$11
  Top 0.254: R1.1 12.62,14.91 arc-45 12.43,14.43 arc-45 11.94,14.22 10.61,14.22 arc-45 R2.2
  Top 0.305: IC1.4 12.56,15.7 arc-45 R1.1
N$12
  Top 0.406: R4.1 18.14,15.59 arc-45 16.35,14.85 15.94,14.85 arc45 D1.1
N$28
  Top 0.305: IC4.1 32.44,10.51 arc45 33.05,9.03 34.98,7.09 arc-45 35.73,5.29 L1.2
N$36
  Top 0.254: LED46.2 arc-45 29.18,6.01 29.23,6.05 arc-45 29.71,6.25 R15.2
PWR  (via drill 0.15)
  Bottom 0.2: IC2.4 15.93,17.93 arc-45 16.15,18.48 arc-45 17,18.82 22.17,18.82 arc-45 22.65,18.62 arc-45 22.82,18.2 22.82,18.18 arc45 23.18,17.32 24.33,16.17 arc45 26.13,15.43 27.1,15.43 arc-45 28.89,14.68 29.48,14.09 arc45 31.28,13.35 31.4,13.35 arc-45 32.59,12.86 33,12.45 arc-45 33.6,11 R13.1
  Bottom 0.305: SW1.3 35.72,10.92 arc-45 33.92,10.18 R13.1 33.6,9.41 arc45 34.34,7.62 J5.2 | SW1.3 | v36.62,11.8 SW1.3
R0  (via drill 0.15)
  Route2 0.254: LED64.1 LED63.1 LED62.1 LED61.1 LED60.1 LED59.1 LED58.1
  Bottom 0.2: LED59.1 arc-45 24.32,11.96 | LED58.1 27.08,11.93 | 14.35,13.55 13.88,13.08 arc45 LED63.1
  Bottom 0.203: IC2.15 14.72,14.46 arc-45 14.35,13.55
  other vias: 10.65,11.93 13.4,11.93 16.15,11.93 18.9,11.93 21.65,11.93 24.4,11.93 27.15,11.93
R1  (via drill 0.15)
  Top 0.2: v13.45,13.57 13.53,13.49 arc-45 14.28,11.7 14.28,11.41 arc-45 14,10.75 13.87,10.62 arc-45 LED55.1
  Route2 0.254: LED56.1 LED55.1 LED54.1 LED53.1 LED52.1 LED51.1 LED50.1
  Bottom 0.203: IC2.16 14.03,14.96 arc-45 v13.45,13.57
  other vias: 10.65,10.43 13.4,10.43 16.15,10.43 18.9,10.43 21.65,10.43 24.4,10.43 27.15,10.43
R2  (via drill 0.15)
  Top 0.2: v12.6,13.6 12.88,13.32 arc-45 13.03,12.97 13.03,12.82 arc-45 12.85,12.4 arc45 12.53,11.62 12.53,10.85 arc45 13.27,9.06 LED37.1
  Route2 0.254: v10.65,8.95 13.34,8.95 arc-45 LED37.1 16.09,8.93 arc-45 v16.15,8.9 18.84,8.9 arc45 LED25.1 LED19.1 LED13.1 LED7.1
  Bottom 0.2: v10.65,8.95 LED43.1
  Bottom 0.203: IC2.17 13.68,15.7 arc45 13.38,15.57 arc45 13.1,14.91 13.1,14.81 arc-45 v12.6,13.6
  Bottom 0.305: LED31.1 v16.15,8.9
  other vias: 13.4,8.93 18.9,8.93 21.65,8.93 24.4,8.93 27.15,8.93
R3  (via drill 0.15)
  Top 0.2: v10.85,13.55 10.57,13.27 arc45 9.82,11.47 9.82,9.3 arc45 10.57,7.51 LED42.1
  Route2 0.254: LED42.1 LED36.1 LED30.1 LED24.1 LED18.1 LED12.1 LED6.1
  Bottom 0.203: IC2.18 13.56,16.1 arc45 13.2,15.95 12.58,15.33 arc45 12.4,14.9 12.4,14.82 arc-45 12.18,14.28 11.87,13.97 arc-45 v10.85,13.55
  other vias: 10.65,7.42 13.43,7.42 16.15,7.42 18.9,7.42 21.65,7.42 24.4,7.42 27.15,7.42
R4  (via drill 0.15)
  Top 0.2: v15.03,13.55 14.66,13.18 arc45 14.5,12.8 arc45 14.8,12.07 14.82,12.05 arc-45 15.05,11.51 15.05,8.08 arc45 15.79,6.28 LED29.1
  Route2 0.254: LED41.1 LED35.1 LED29.1 LED23.1 LED17.1 LED11.1 27.09,5.92 arc-45 LED5.1
  Bottom 0.2: LED41.1 arc-45 10.59,5.95
  Bottom 0.203: IC2.14 15.12,13.79 arc-45 v15.03,13.55
  other vias: 10.65,5.92 13.4,5.92 16.15,5.92 18.9,5.92 21.65,5.92 24.4,5.92 27.15,5.9
R5  (via drill 0.15)
  Top 0.2: v15.65,13.2 15.65,12.28 arc-45 15.57,12.1 arc45 15.47,11.86 15.47,9.32 arc45 15.88,8.35 arc45 16.36,8.15 16.4,8.15 arc-45 16.7,8.03 16.82,7.9 arc-45 17.05,7.36 17.05,6.25 arc-45 16.4,4.67 LED28.1
  Route2 0.254: LED40.1 LED34.1 LED28.1 LED22.1 LED16.1 LED10.1 LED4.1
  Bottom 0.2: LED40.1 10.62,4.4
  Bottom 0.203: IC2.13 15.53,13.9 arc45 15.57,13.78 arc-45 15.65,13.59 v15.65,13.2
  other vias: 10.65,4.42 13.4,4.42 16.15,4.42 18.9,4.42 21.65,4.42 24.4,4.42 27.15,4.42
R6  (via drill 0.15)
  Top 0.2: LED27.1 16.73,3.51 arc45 17.48,5.3 17.48,8.4 arc45 17.23,9 arc-45 16.77,10.09 16.77,11.86 arc45 16.47,12.61 v16.27,12.8
  Route2 0.254: LED39.1 LED33.1 LED27.1 LED21.1 LED15.1 LED9.1 LED3.1
  Bottom 0.2: IC2.12 15.93,14.05 arc45 16.1,13.62 arc-45 16.27,13.2 v16.27,12.8
  Bottom 0.203: IC2.12 15.93,14.21
  other vias: 10.65,2.92 13.4,2.92 16.15,2.92 18.9,2.92 21.65,2.92 24.4,2.92 27.15,2.92
R7  (via drill 0.15)
  Top 0.2: LED20.1 18.69,1.63 arc-45 17.95,3.43 17.95,8.39 arc45 17.5,9.47 arc-45 17.18,10.26 17.18,12.05 16.77,13.02 arc45 16.77,13.03 arc-45 16.73,13.15 v16.73,13.68 16.73,13.55
  Route2 0.254: LED38.1 LED32.1 LED26.1 LED20.1 LED14.1 LED8.1 LED2.1
  Bottom 0.2: 10.53,1.48 arc45 LED38.1
  Bottom 0.203: v16.73,13.68 16.35,14.57 arc45 IC2.11
  other vias: 10.65,1.43 13.4,1.43 16.15,1.43 18.9,1.43 21.65,1.43 24.4,1.43 27.15,1.43
UPDI  (via drill 0.15)
  Route15 0.2: v11.72,14.85 11.76,14.81 arc45 13,14.3 18.2,14.3 arc-45 19.35,13.82 19.54,13.63 arc-45 19.82,12.95 arc45 20.3,11.8 20.57,11.53 arc45 21.36,11.2 29.37,11.2 arc-45 31.17,10.46 32.18,9.45 arc-45 v32.85,7.83
  Bottom 0.2: J5.3 32.94,7.61 arc-45 v32.85,7.83 arc-45 32.3,9.15 R13.2 | IC2.19 13.64,16.5 arc45 12.68,16.1 11.94,15.36 arc45 v11.72,14.85
VBAT
  Top 0.2: C8.1 28.93,12.05 arc-45 R3.2
  Top 0.406: R4.2 25.02,15.82 arc-45 26.82,16.57 Q3.2 30.34,13.82 arc-45 C8.1
VBUS  (via drill 0.15)
  Top 0.254: IC1.1 8.14,17.6 arc-45 8.8,17.32 arc-45 9.03,16.78 9.03,16.45 arc-45 8.79,15.89 8.78,15.88 arc-45 8.35,15.7 IC1.3 | Q3.1 25.4,18.48 arc45 R16.2
  Top 0.508: X4.B4A9 v7.9,7.62 | X4.A4B9 v7.92,12.43 | C1.1 arc45 7.33,17.6 IC1.1
  Route15 0.254: C1.1 6.26,17.64 arc45 8.05,16.9 22.75,16.9 arc45 24.54,17.64 R16.2
  Bottom 0.508: v7.9,7.62 v7.92,12.43 8.13,12.63 arc45 8.68,13.95 8.68,14.15 arc45 7.41,17.21 6.81,17.82 arc45 C1.1
  other vias: 5.58,18.32 25.38,18.48
VCCIO  (via drill 0.15)
  Top 0.305: v35.55,12.88 arc-45 34.61,13.26 IC4.2 arc-45 33.4,13.76 C24.1
  Route14 0.254: v35.55,12.88 34.72,12.04 arc45 33.98,10.25 33.98,8.68 | 33.98,8.68 33.98,8.55 | 33.98,8.68 arc-45 33.52,7.57 R15.1
  Bottom 0.305: SW1.2 v35.55,12.88 | v35.55,12.88 arc-45 v35.55,12.88
  other vias: 32.2,6.25
VLEV  (via drill 0.15)
  Top 0.2: R3.1 arc-45 29,10.72 v29.88,9.85 arc-45 29.8,9.68 R6.2
  Route3 0.2: v18.52,12.9 18.72,12.7 arc45 19.45,12.4 arc-45 20.05,12.15 20.27,11.93 arc45 21.96,11.22 27.93,11.22 arc-45 28.91,10.82 v29.88,9.85
  Bottom 0.2: IC2.10 17.89,14.44 arc-45 v18.52,12.9
VOUT  (via drill 0.15)
  Top 0.254: IC4.4 32.61,17.66 32.77,17.95 C25.1 | L1.1 v37.05,7.45
  Top 0.305: Q3.3 30.42,17.52 arc-45 IC4.4 32.05,17.11 arc-45 32.4,17.25 arc-45 32.74,17.11 33.54,16.31 arc-45 33.65,16.05 arc-45 33.43,15.51 IC4.3
  Route15 0.406: Q3.3 arc45 30.37,15.9 32.12,14.15 arc-45 32.7,12.76 arc45 33.38,11.12 v37.05,7.45
  other vias: 29.7,17.52

### Text on the board
Top: by Tanmoy
Bottom: Confundus / v3
tNames: Again and Again